# EasyEDA Pro project WukongY003.eprj, board PCB1
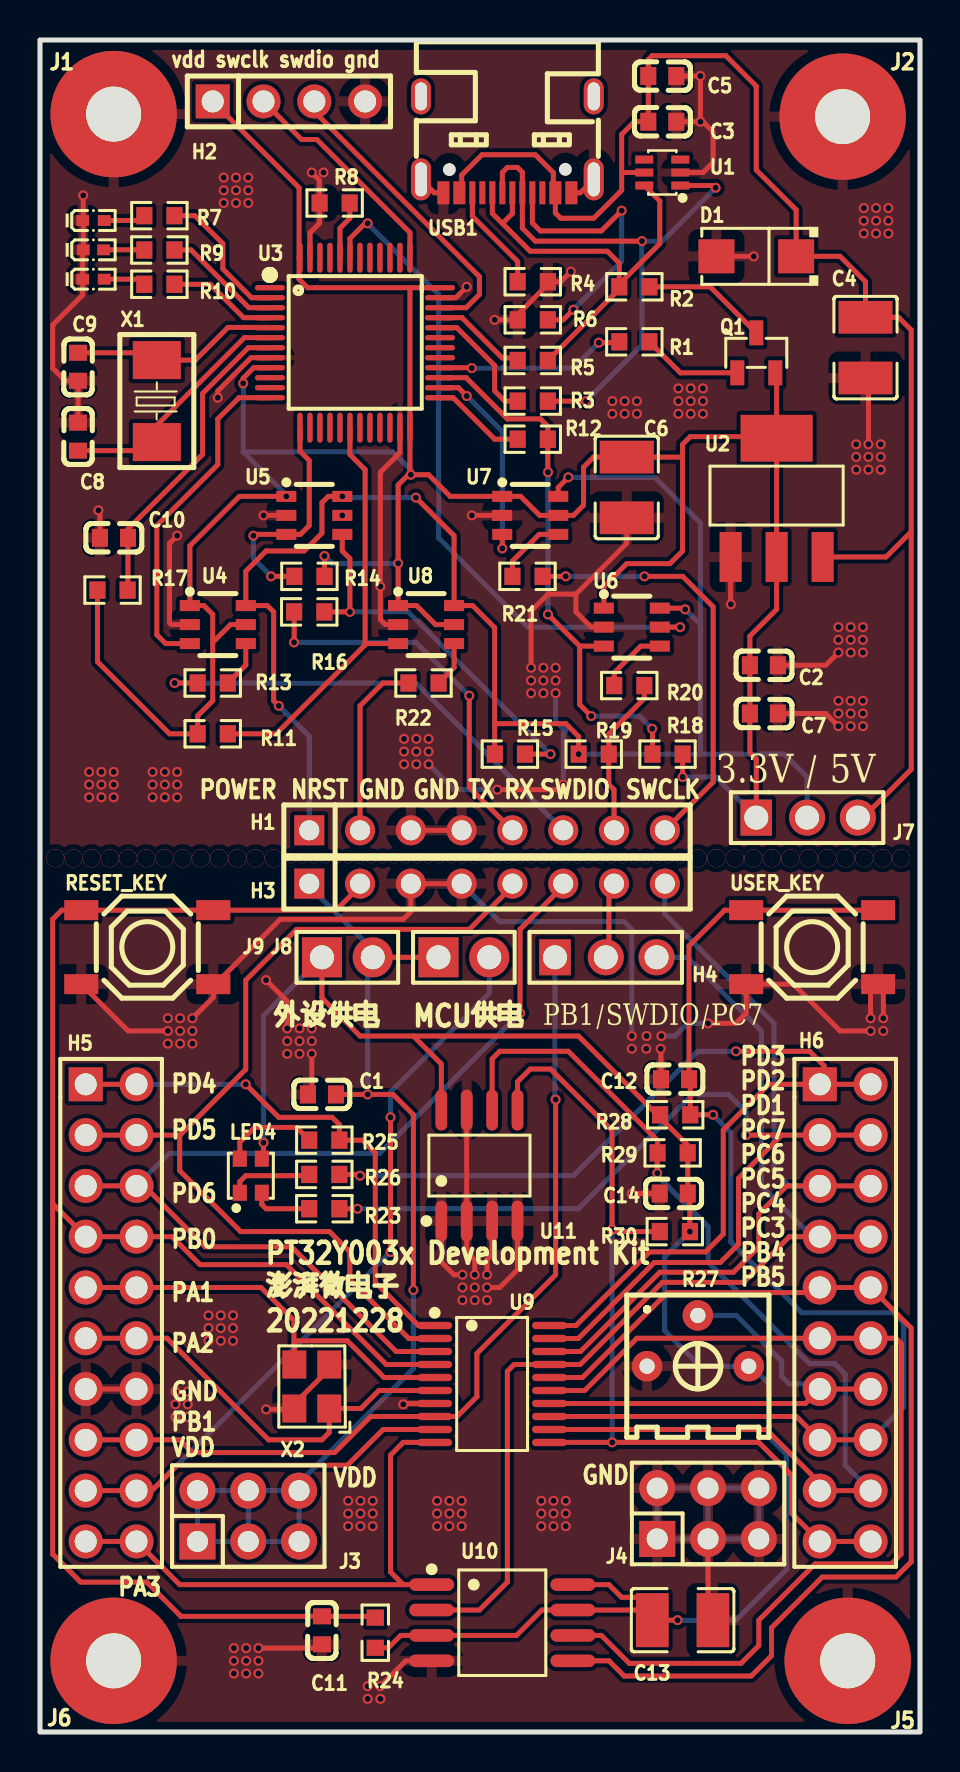
[diagram p3: board, top side]
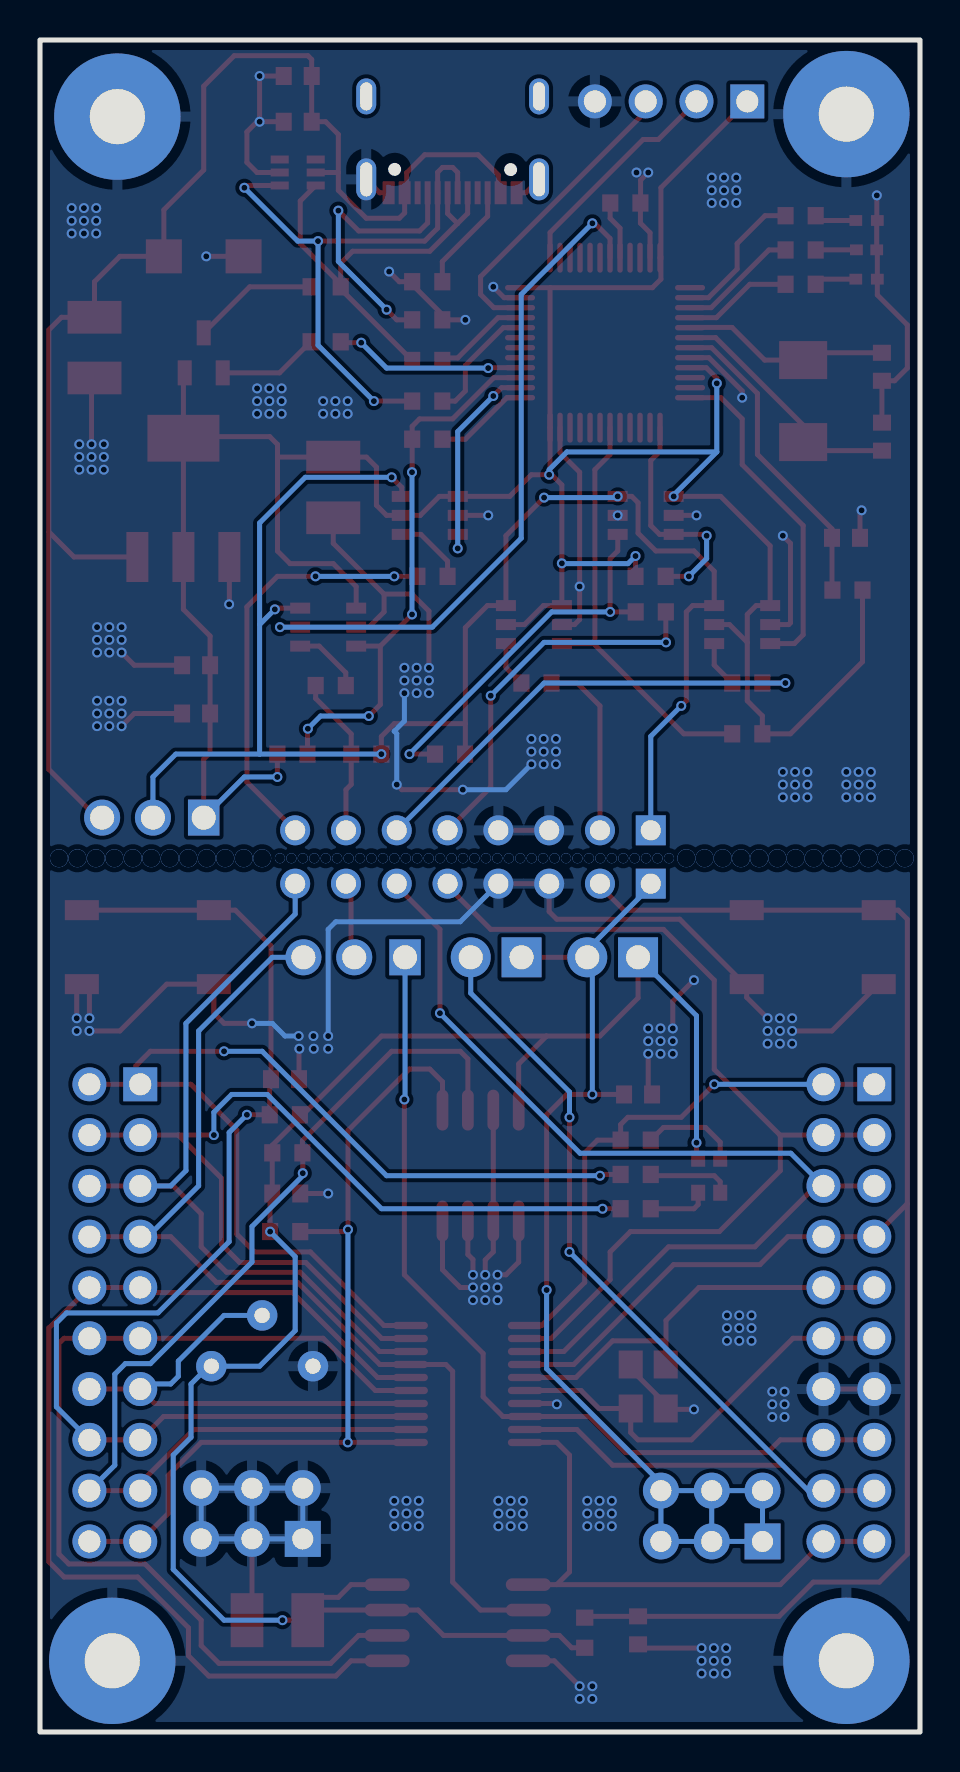
[diagram p4: board, bottom side, seen from below]

Outline 44 x 84.61 mm; copper layers: Top Layer, Bottom Layer. Coordinates in mm from the lower left corner of the outline.
Outline path: rectangle 0,84.61 44,0
Stack: Top Layer 0.035mm / Dielectric1 1.51mm FR4 er 4.5 / Bottom Layer 0.035mm

## Design rules (mm)
spacing safeClearance (default): track to track 0.152, other pairs 0.152 to 0.3
track width trackWidth (default): min 0.127, default 0.254, max 2.54
differential pair differentialPair (default): width min 0.127, default 0.254, max 2.54; gap min 0.152, default 0.152
via viaSize (default): diameter min 0.5, default 0.61, max 10; hole min 0.3, default 0.305, max 6
net 3.3V uses 铺铜-直连
net 5V uses 铺铜-直连

## Placement (name value [footprint] x y rotation side)
C1  100nF  [C0603]  14.1 31.88 0 top
C2  100nF  [C0603]  36.19 53.34 180 top
C3  100nF  [C0603]  31.11 80.52 180 top
C4  10uF  [C1210]  41.27 69.23 90 top
C5  100nF  [C0603]  31.11 82.81 180 top
C6  10uF  [C1210]  29.34 62.23 90 top
C7  100nF  [C0603]  36.19 50.93 180 top
C8  20pF  [C0603]  1.9 64.77 270 top
C9  20pF  [C0603]  1.91 68.27 90 top
C10  100nF  [C0603]  3.7 59.72 0 top
C11  100nF  [C0603]  14.1 5.08 90 top
C12  100nF  [C0603]  31.75 32.64 0 top
C13  10uF  [C1210]  32.13 5.59 0 top
C14  100nF  [C0603]  31.69 26.93 0 top
D1  SMAJ5.0CA  [SMA_L4.3-W2.7-LS4.7-RD]  35.81 73.79 180 top
H1  KH-2.54PH180-1X8P-L11.5  [HDR-TH_8P-P2.54-V-M]  22.35 45.09 0 top
H2  KH-2.54PH180-1X4P-L11.5  [HDR-TH_4P-P2.54-V-M]  12.45 81.54 0 top
H3  KH-2.54PH180-1X8P-L11.5  [HDR-TH_8P-P2.54-V-M]  22.35 42.42 0 top
H4  2.54-1*3  [HDR-TH_3P-P2.54-V-M-1]  28.29 38.74 0 top
H5  2.54-2*10  [HDR-TH_20P-P2.54-V-M-R2-C10-S2.54]  3.56 20.96 270 top
H6  2.54-2*10  [HDR-TH_20P-P2.54-V-M-R2-C10-S2.54]  40.26 20.96 270 top
J1  -  [DEMO板安装孔]  3.68 80.9 0 top
J2  -  [DEMO板安装孔]  40.13 80.78 0 top
J3  2.54-2*3P针  [HDR-TH_6P-P2.54-V-M-R2-C3-S2.54-1]  10.41 10.8 0 top
J4  2.54-2*3P针  [HDR-TH_6P-P2.54-V-M-R2-C3-S2.54-1]  33.4 10.93 0 top
J5  -  [DEMO板安装孔]  40.39 3.56 0 top
J6  -  [DEMO板安装孔]  3.68 3.56 0 top
J7  2.54-1*3  [HDR-TH_3P-P2.54-V-M-1]  38.35 45.72 0 top
J8  2.54-1*2  [HDR-TH_2P-P2.54-V-M]  21.19 38.74 0 top
J9  2.54-1*2  [HDR-TH_2P-P2.54-V-M]  15.37 38.74 0 top
LED1  RF-GN0402TS-CF-B  [LED0402-RD_GREEN]  2.67 75.58 0 top
LED2  RF-RU0402TS-BC-B1  [LED0402-RD_RED]  2.67 74.12 0 top
LED3  RF-GN0402TS-CF-B  [LED0402-RD_GREEN]  2.67 72.65 0 top
LED4  FM-B2020RGBA-HG  [LED-SMD_FM-B2020RGBA-HG]  10.54 27.82 90 top
Q1  SS8550 Y2  [SOT-23-3_L2.9-W1.3-P1.90-LS2.4-BR]  35.81 68.96 270 top
R1  1.5kΩ  [R0603]  29.72 69.52 180 top
R2  1.5kΩ  [R0603]  29.72 72.27 0 top
R3  27Ω  [R0603]  24.64 66.55 180 top
R4  5.1kΩ  [R0603]  24.64 72.52 0 top
R5  27Ω  [R0603]  24.64 68.58 180 top
R6  5.1kΩ  [R0603]  24.64 70.62 0 top
R7  4.7kΩ  [R0603]  5.97 75.82 0 top
R8  10kΩ  [R0603]  14.73 76.46 180 top
R9  4.7kΩ  [R0603]  5.97 74.11 0 top
R10  4.7kΩ  [R0603]  5.97 72.39 0 top
R11  10kΩ  [R0603]  8.64 49.91 0 top
R12  100Ω  [R0603]  24.64 64.65 0 top
R13  220Ω  [R0603]  8.64 52.45 180 top
R14  10kΩ  [R0603]  13.47 57.79 0 top
R15  10kΩ  [R0603]  23.5 48.9 0 top
R16  220Ω  [R0603]  13.46 56.01 180 top
R17  10kΩ  [R0603]  3.63 57.1 180 top
R18  10kΩ  [R0603]  31.38 48.9 0 top
R19  10kΩ  [R0603]  27.69 48.9 0 top
R20  220Ω  [R0603]  29.46 52.33 0 top
R21  220Ω  [R0603]  24.38 57.79 0 top
R22  220Ω  [R0603]  19.18 52.45 180 top
R23  4.7kΩ  [R0603]  14.22 26.17 180 top
R24  10kΩ  [R0603]  16.76 4.97 270 top
R25  4.7kΩ  [R0603]  14.22 29.59 180 top
R26  4.7kΩ  [R0603]  14.22 27.88 180 top
R27  环保  3362P-1-101LF  [RES-ADJ-TH_3362P]  32.89 19.56 0 top
R28  10kΩ  [R0603]  31.76 30.86 180 top
R29  10kΩ  [R0603]  31.63 28.96 0 top
R30  10kΩ  [R0603]  31.74 25.02 0 top
RESET_KEY  1TS001G-2500-1500-CT  [SW-SMD_4P-L5.1-W5.1-P3.70-LS6.5-TL-2]  5.36 39.25 0 top
U1  NUP4202W1T2G  [SOT-363_L2.0-W1.3-P0.65-LS2.1-BR]  31.11 77.98 0 top
U2  AMS1117-3.3  [SOT-223-3_L6.4-W3.5-P2.30-LS7.0-BR]  36.83 61.73 270 top
U3  STM32F103CBT6  [LQFP-48_L7.0-W7.0-P0.50-LS9.0-BL]  15.75 69.47 270 top
U4  SN74LVC1T45DBVR  [SOT-23-6_L2.9-W1.6-P0.95-LS2.8-BR]  8.89 55.38 180 top
U5  SN74LVC1T45DBVR  [SOT-23-6_L2.9-W1.6-P0.95-LS2.8-BR]  13.72 60.84 180 top
U6  SN74LVC1T45DBVR  [SOT-23-6_L2.9-W1.6-P0.95-LS2.8-BR]  29.59 55.25 180 top
U7  SN74LVC1T45DBVR  [SOT-23-6_L2.9-W1.6-P0.95-LS2.8-BR]  24.51 60.84 180 top
U8  SN74LVC1T45DBVR  [SOT-23-6_L2.9-W1.6-P0.95-LS2.8-BR]  19.3 55.38 180 top
U9  -  [TSSOP-20_L6.5-W4.4-P0.65-LS6.4-BL]  22.61 17.4 270 top
U10  W25Q64JVSSIQ  [SOIC-8_L5.3-W5.3-P1.27-LS8.0-BL]  23.11 5.47 270 top
U11  K24C02  [SOIC-8_L4.9-W3.9-P1.27-LS6.0-BL]  21.97 28.32 0 top
USB1  TYPEC-304-ACP16  [USB-C-SMD_TYPE-C-16P-1]  23.37 79.38 180 top
USER_KEY  1TS001G-2500-1500-CT  [SW-SMD_4P-L5.1-W5.1-P3.70-LS6.5-TL-2]  38.61 39.25 0 top
X1  8MHz  [CRYSTAL-SMD_L5.0-W3.2]  5.84 66.55 270 top
X2  25MHz  [OSC-SMD_4P-L3.2-W2.5-BL]  13.59 17.28 90 top

## Footprints (pads in the part's own frame, mm; a bottom-side part is the same pattern mirrored in y, then rotated)
C0603
  rect 0.8x0.9 smd: 1(-0.7,0) 2(0.7,0)
C1210
  rect 1.635x2.7 smd: 1(-1.518,0) 2(1.518,0)
CRYSTAL-SMD_L5.0-W3.2
  rect 1.9x2.401 smd: 1(-2.05,0) 2(2.05,0)
DEMO板安装孔
  round 6.32 hole 2.75: 1(0,0)
HDR-TH_2P-P2.54-V-M
  rect 2x2 hole 1.2: 1(-1.27,0)
  round 2 hole 1.2: 2(1.27,0)
HDR-TH_3P-P2.54-V-M-1
  rect 1.575x1.801 hole 1.199: 1(-2.54,0)
  round 1.801 hole 1.199: 2(0,0) 3(2.54,0)
HDR-TH_4P-P2.54-V-M
  rect 1.7x1.7 hole 1.1: 1(-3.81,0)
  round 1.7 hole 1.1: 2(-1.27,0) 3(1.27,0) 4(3.81,0)
HDR-TH_6P-P2.54-V-M-R2-C3-S2.54-1
  rect 1.801x1.801 hole 1.049: 1(-2.54,-1.27)
  round 1.801 hole 1.049: 2(-2.54,1.27) 3(0,-1.27) 4(0,1.27) 5(2.54,-1.27) 6(2.54,1.27)
HDR-TH_8P-P2.54-V-M
  rect 1.5x1.5 hole 1: 1(-8.89,0)
  round 1.5 hole 1: 2(-6.35,0) 3(-3.81,0) 4(-1.27,0) 5(1.27,0) 6(3.81,0) 7(6.35,0) 8(8.89,0)
HDR-TH_20P-P2.54-V-M-R2-C10-S2.54
  rect 1.7x1.7 hole 1.1: 1(-11.43,-1.27)
  round 1.7 hole 1.1: 2(-11.43,1.27) 3(-8.89,-1.27) 4(-8.89,1.27) 5(-6.35,-1.27) 6(-6.35,1.27) 7(-3.81,-1.27) 8(-3.81,1.27) 9(-1.27,-1.27) 10(-1.27,1.27) 11(1.27,-1.27) 12(1.27,1.27) 13(3.81,-1.27) 14(3.81,1.27) 15(6.35,-1.27) 16(6.35,1.27) 17(8.89,-1.27) 18(8.89,1.27) 19(11.43,-1.27) 20(11.43,1.27)
LED0402-RD_GREEN
  rect 0.637x0.541 smd: 1(-0.538,0) 2(0.538,0)
LED0402-RD_RED
  rect 0.637x0.541 smd: 1(-0.508,0) 2(0.508,0)
LED-SMD_FM-B2020RGBA-HG
  rect 0.8x0.701 smd: 1(-0.851,0.551) 2(0.851,0.551) 3(0.851,-0.551) 4(-0.851,-0.551)
LQFP-48_L7.0-W7.0-P0.50-LS9.0-BL
  oval 0.27x1.5 smd: 1(-2.75,-4.25) 2(-2.25,-4.25) 3(-1.75,-4.25) 4(-1.25,-4.25) 5(-0.75,-4.25) 6(-0.25,-4.25) 7(0.25,-4.25) 8(0.75,-4.25) 9(1.25,-4.25) 10(1.75,-4.25) 11(2.25,-4.25) 12(2.75,-4.25) 25(2.75,4.25) 26(2.25,4.25) 27(1.75,4.25) 28(1.25,4.25) 29(0.75,4.25) 30(0.25,4.25) 31(-0.25,4.25) 32(-0.75,4.25) 33(-1.25,4.25) 34(-1.75,4.25) 35(-2.25,4.25) 36(-2.75,4.25)
  oval 1.5x0.27 smd: 13(4.25,-2.75) 14(4.25,-2.25) 15(4.25,-1.75) 16(4.25,-1.25) 17(4.25,-0.75) 18(4.25,-0.25) 19(4.25,0.25) 20(4.25,0.75) 21(4.25,1.25) 22(4.25,1.75) 23(4.25,2.25) 24(4.25,2.75) 37(-4.25,2.75) 38(-4.25,2.25) 39(-4.25,1.75) 40(-4.25,1.25) 41(-4.25,0.75) 42(-4.25,0.25) 43(-4.25,-0.25) 44(-4.25,-0.75) 45(-4.25,-1.25) 46(-4.25,-1.75) 47(-4.25,-2.25) 48(-4.25,-2.75)
OSC-SMD_4P-L3.2-W2.5-BL
  rect 1.4x1.2 smd: 1(-1.1,-0.875) 2(1.1,-0.875) 3(1.1,0.875) 4(-1.1,0.875)
R0603
  rect 0.806x0.864 smd: 1(-0.753,0) 2(0.753,0)
RES-ADJ-TH_3362P
  round 1.524 hole 0.762: 1(-2.54,-1.27) 2(0,1.27) 3(2.54,-1.27)
SMA_L4.3-W2.7-LS4.7-RD
  rect 1.8x1.7 smd: 1(-1.992,0) 2(1.992,0)
SOIC-8_L4.9-W3.9-P1.27-LS6.0-BL
  oval 0.588x2.045 smd: 1(-1.905,-2.772) 2(-0.635,-2.772) 3(0.635,-2.772) 4(1.905,-2.772) 5(1.905,2.772) 6(0.635,2.772) 7(-0.635,2.772) 8(-1.905,2.772)
SOIC-8_L5.3-W5.3-P1.27-LS8.0-BL
  oval 0.63x2.25 smd: 1(-1.905,-3.53) 2(-0.635,-3.53) 3(0.635,-3.53) 4(1.905,-3.53) 5(1.905,3.53) 6(0.635,3.53) 7(-0.635,3.53) 8(-1.905,3.53)
SOT-23-3_L2.9-W1.3-P1.90-LS2.4-BR
  rect 1.25x0.7 smd: 1(1,-0.95) 2(1,0.95) 3(-1,0)
SOT-23-6_L2.9-W1.6-P0.95-LS2.8-BR
  rect 1x0.55 smd: 1(1.4,-0.95) 2(1.4,0) 3(1.4,0.95) 4(-1.4,0.95) 5(-1.4,0) 6(-1.4,-0.95)
SOT-223-3_L6.4-W3.5-P2.30-LS7.0-BR
  rect 2.499x1.1 smd: 1(2.97,-2.299) 2(2.97,0) 3(2.97,2.301)
  rect 2.34x3.599 smd: 4(-2.97,0)
SOT-363_L2.0-W1.3-P0.65-LS2.1-BR
  rect 0.9x0.4 smd: 1(0.9,-0.65) 2(0.9,0) 3(0.9,0.65) 4(-0.9,0.65) 5(-0.9,0) 6(-0.9,-0.65)
SW-SMD_4P-L5.1-W5.1-P3.70-LS6.5-TL-2
  rect 1.7x1 smd: 1(-3.3,1.85) 2(3.3,1.85) 3(-3.3,-1.85) 4(3.3,-1.85)
TSSOP-20_L6.5-W4.4-P0.65-LS6.4-BL
  oval 0.364x1.742 smd: 1(-2.925,-2.871) 2(-2.275,-2.871) 3(-1.625,-2.871) 4(-0.975,-2.871) 5(-0.325,-2.871) 6(0.325,-2.871) 7(0.975,-2.871) 8(1.625,-2.871) 9(2.275,-2.871) 10(2.925,-2.871) 11(2.925,2.871) 12(2.275,2.871) 13(1.625,2.871) 14(0.975,2.871) 15(0.325,2.871) 16(-0.325,2.871) 17(-0.975,2.871) 18(-1.625,2.871) 19(-2.275,2.871) 20(-2.925,2.871)
USB-C-SMD_TYPE-C-16P-1
  rect 0.6x1.15 smd: A1B12(-3.2,2.41) A4B9(-2.4,2.41) B1A12(3.2,2.41) B4A9(2.4,2.41)
  rect 0.3x1.15 smd: A5(-1.25,2.41) A6(-0.25,2.41) A7(0.25,2.41) A8(1.25,2.41) B5(1.75,2.41) B6(0.75,2.41) B7(-0.75,2.41) B8(-1.75,2.41)
  oval 1x2.1 hole 0.6x1.7: EP(-4.32,1.74) EP(4.32,1.74)
  oval 1x1.8 hole 0.6x1.4: EP(-4.32,-2.41) EP(4.32,-2.41)

## Nets
As in the schematic.

Pads without a net: U1 3 4; U3 1 10 11 14 15 16 17 19 20 21 22 29 30 31 38 39 40 41 42 45 46; USB1 A8 B8

## Via types
v1: diameter 0.9, hole 0.9, Top Layer to Bottom Layer, 25 vias
v2: diameter 0.5, hole 0.5, Top Layer to Bottom Layer, 35 vias
v3: diameter 0.5, hole 0.3, Top Layer to Bottom Layer, 266 vias

## Routing (per net, layer and track width the routed paths; a pad name or vN(x,y) marks a point on that pad's centre or on a via; arc(x,y) is an arc through that point)
3.3V: length 149.7
  Top Layer w0.25: 35.81,45.47 35.81,48.64 35.5,48.96 C7.2 C2.2 35.5,54.8 36.83,56.14 U2.2 U2.4 ; R17.2 2.87,53.52 6.48,49.91 R11.1 7.88,50.81 8.64,51.57 8.64,54.49 ; U2.4 36.83,67.9 Q1.2 ; U2.4 36.75,64.77 32.51,64.77 32.12,64.39 32.12,63.75 ; 18.47,72.22 18.5,72.2 U3.24 18.5,62.91 v3(18.54,62.87) ; 18.47,72.22 13.38,72.22 12.95,72.65 12.95,73.68 U3.48 12.95,73.77 12.95,77.22 H2.1 ; 18.47,72.22 U3.36 ; 32.12,63.75 32.12,59.05 31.5,58.42 29.34,58.42 28.19,57.28 U6.1 ; 32.12,63.75 C6.2 27.68,63.75 27.18,63.25 27.18,61.34 26.67,60.84 U7.5 24.99,60.84 24.04,61.79 U7.1 20.51,61.79 19.43,62.87 v3(18.54,62.87) ; U4.5 9.52,55.38 8.64,54.49 ; 8.64,54.49 8.64,55.88 8.19,56.33 U4.1 7.49,56.33 7.49,59.31 9.97,61.79 v3(12.32,61.79) ; v3(32.13,47.76) R18.2 ; v3(18.54,62.87) 18.41,62.87 17.91,62.36 v3(17.91,58.44) 17.91,56.33 U8.1 18.83,56.33 19.78,55.38 U8.5 ; U3.9 10.69,68.22 10.16,67.69 v3(10.16,67.44) ; v3(14.22,58.8) R14.2
  Bottom Layer w0.25: 10.16,64.01 12.32,61.85 ; 10.16,64.01 17.65,64.01 18.54,63.12 v3(18.54,62.87) ; 10.16,64.01 v3(10.16,67.44) ; v3(14.22,58.8) 14.6,58.42 17.91,58.42 ; J7.1 33.78,47.76 v3(32.13,47.76)
5V: length 75.5
  Top Layer w0.25: 29.08,77.98 U1.5 ; 29.08,77.98 29.08,77.09 27.69,75.7 26.03,75.7 25.77,75.96 USB1.A4B9 25.67,77.07 25.67,77.97 24.76,78.87 22.1,78.87 21.08,77.85 21.08,77.08 USB1.B4A9 ; 29.08,77.98 29.08,79.89 29.72,80.52 C3.2 C5.2 30.41,83.63 30.61,83.82 34.29,83.82 35.81,82.3 35.81,78.11 37.81,76.12 D1.1 40,73.79 41.27,72.52 C4.2 42.93,70.74 43.56,70.11 43.56,60.02 ; 43.56,60.02 43.56,48.14 40.89,45.47 ; 43.56,60.02 42.3,58.76 U2.3
GND: length 219.8
  Top Layer w0.25: v3(22.35,22.86) 22.35,23.63 22.61,23.88 U11.3 ; v3(10.92,4.19) 13.91,4.19 C11.1 ; C10.1 3,61.01 v3(2.92,61.09) ; U11.1 20.07,23.5 20.7,22.86 v3(21.12,22.86) ; v3(26.16,47.37) 25.91,47.12 v3(22.86,47.12) ; v3(41.42,64.39) 41.42,67.56 C4.1 ; v3(2.16,76.84) 2.16,75.61 LED1.1 2.16,75.55 LED2.1 2.13,74.08 LED3.1 2.13,71.86 0.63,70.36 0.63,68.2 1.27,67.57 C9.1 1.91,65.48 C8.1 ; v3(33.4,35.44) 34.8,35.44 35.31,35.95 USER_KEY.3 37.66,37.4 40,35.06 v3(41.53,35.06) ; X2.2 14.46,18.15 12.71,16.4 X2.4 12.67,16.13 v3(11.3,16.13) ; RESET_KEY.3 4.41,35.06 v3(6.39,35.06) ; U4.2 6.56,55.38 6.48,55.46 6.48,59.44 v3(6.86,59.82) ; v3(12.36,35.18) 12.36,36.54 11.43,37.47 ; C6.1 29.34,59.44 26.8,56.9 ; C13.2 33.4,5.84 J4.3 ; 26.8,56.9 25.4,56.9 24.55,56.05 v3(24.55,53.22) ; 26.8,56.9 26.8,56.01 27.56,55.25 U6.2 ; U10.4 18.29,3.56 v3(17.02,2.29) ; v3(33.02,80.52) v3(33.02,82.81) C5.1 ; v3(33.02,80.52) C3.1 ; v3(33.02,80.52) 33.15,80.52 33.66,80.01 33.66,78.49 33.15,77.98 U1.2 ; U8.2 17.27,55.38 17.02,55.63 v3(17.02,57.28) 17.02,63 18,63.98 U3.23 ; USB1.EP 19.72,76.97 USB1.B1A12 ; USB1.A1B12 27.02,76.97 USB1.EP ; v3(41.53,35.69) 41.53,37.02 USER_KEY.4 42.16,37.14 v3(42.16,35.69) ; U7.2 v3(21.59,60.84) ; C1.1 13.59,32.07 v3(13.59,33.91) ; C2.1 39.28,53.34 v3(39.92,53.98) ; 12.32,60.84 v3(11.18,60.84) ; v3(21.74,22.86) 21.74,23.6 21.34,24.01 U11.2 U11.7 ; 8.89,66.81 8.89,67.06 10.55,68.72 U3.8 ; v3(22.73,70.62) R6.1 23.88,70.88 25.39,72.39 R4.2 26.03,72.52 v3(26.54,73.03) ; v3(29.59,26.93) C14.1 ; v3(18.16,16.39) 18.2,16.43 U9.7 ; v3(7.62,35.69) 8.66,36.74 RESET_KEY.4 8.77,37.4 12.01,40.64 18.16,40.64 18.54,41.02 H3.3 H3.4 ; v3(13.59,77.98) 13.97,77.6 13.97,76.47 R8.2 13.98,75.45 13.5,74.97 U3.47 ; C7.1 39.28,50.93 v3(39.92,50.3) ; v3(21.34,72.27) 20.79,71.72 U3.35 ; v3(31.03,34.17) 31.05,34.15 31.05,32.64 ; v3(34.54,56.39) 34.53,56.4 U2.1 ; v3(22.35,22.23) 22.99,22.23 23.88,23.12 U11.4 ; H5.13 H5.14 ; D1.2 v3(35.69,73.79) ; H1.3 H1.4
  Bottom Layer w0.25: v3(25.78,51.95) 25.78,50.55 26.29,50.04 26.16,49.91 v3(26.16,47.37) ; J4.3 J4.4 ; J4.3 J4.5 J4.6 J4.4 ; J4.3 J4.1 J4.2 J4.4 ; v3(29.59,34.8) 29.59,40.14 29.21,40.52 22.99,40.52 H3.4 ; v3(33.4,35.44) 32.38,35.44 31.75,34.8 v3(31.07,34.8) ; v3(19.43,48.39) 20.7,47.12 v3(22.86,47.12)
  vias: v3(2.45,48.01) v3(2.45,47.37) v3(2.45,46.74) v3(3.07,48.01) v3(3.07,47.37) v3(3.07,46.74) v3(3.68,48.01) v3(3.68,47.37) v3(3.68,46.74) v3(5.63,48.01) v3(5.63,47.37) v3(5.63,46.74) v3(6.24,48.01) v3(6.24,47.37) v3(6.24,46.74) v3(6.39,35.69) v3(6.39,34.42) v3(6.77,17.02) v3(6.77,16.39) v3(6.77,15.75) v3(6.86,48.01) v3(6.86,47.37) v3(6.86,46.74) v3(7.01,35.69) v3(7.01,35.06) v3(7.01,34.42) v3(7.39,17.02) v3(7.39,16.39) v3(7.39,15.75) v3(7.62,35.06) v3(7.62,34.42) v3(8.42,20.83) v3(8.42,20.2) v3(8.42,19.56) v3(8.89,66.72) v3(9.04,20.83) v3(9.04,20.2) v3(9.04,19.56) v3(9.19,77.73) v3(9.19,77.09) v3(9.19,76.46) v3(9.65,20.83) v3(9.65,20.2) v3(9.65,19.56) v3(9.69,4.19) v3(9.69,3.56) v3(9.69,2.92) v3(9.8,77.73) v3(9.8,77.09) v3(9.8,76.46) v3(10.31,4.19) v3(10.31,3.56) v3(10.31,2.92) v3(10.41,77.73) v3(10.41,77.09) v3(10.41,76.46) v3(10.92,3.56) v3(10.92,2.92) v3(11.3,37.6) v3(12.36,34.55) v3(12.36,33.91) v3(12.97,35.18) v3(12.97,34.55) v3(12.97,33.91) v3(13.59,35.18) v3(13.59,34.55) v3(14.18,77.98) v3(15.12,60.84) v3(15.41,11.56) v3(15.41,10.93) v3(15.41,10.29) v3(16.02,11.56) v3(16.02,10.93) v3(16.02,10.29) v3(16.38,2.29) v3(16.38,1.66) v3(16.64,11.56) v3(16.64,10.93) v3(16.64,10.29) v3(17.02,1.66) v3(18.2,49.66) v3(18.2,49.03) v3(18.2,48.39) v3(18.82,49.66) v3(18.82,49.03) v3(18.82,48.39) v3(19.43,49.66) v3(19.43,49.03) v3(19.85,11.56) v3(19.85,10.93) v3(19.85,10.29) v3(20.47,11.56) v3(20.47,10.93) v3(20.47,10.29) v3(21.08,11.56) v3(21.08,10.93) v3(21.08,10.29) v3(21.12,22.23) v3(21.12,21.59) v3(21.74,22.23) v3(21.74,21.59) v3(22.35,21.59) v3(24.55,52.58) v3(24.55,51.95) v3(25.06,11.56) v3(25.06,10.93) v3(25.06,10.29) v3(25.17,53.22) v3(25.17,52.58) v3(25.17,51.95) v3(25.67,11.56) v3(25.67,10.93) v3(25.67,10.29) v3(25.78,53.22) v3(25.78,52.58) v3(26.29,11.56) v3(26.29,10.93) v3(26.29,10.29) v3(28.62,66.55) v3(28.62,65.92) v3(29.23,66.55) v3(29.23,65.92) v3(29.59,34.17) v3(29.84,66.55) v3(29.84,65.92) v3(30.31,34.17) v3(30.33,34.8) v3(31.92,67.19) v3(31.92,66.55) v3(31.92,65.92) v3(32.53,67.19) v3(32.53,66.55) v3(32.53,65.92) v3(33.15,67.19) v3(33.15,66.55) v3(33.15,65.92) v3(39.92,55.25) v3(39.92,54.61) v3(39.92,51.57) v3(39.92,50.93) v3(40.53,55.25) v3(40.53,54.61) v3(40.53,53.98) v3(40.53,51.57) v3(40.53,50.93) v3(40.53,50.3) v3(40.81,64.39) v3(40.81,63.76) v3(40.81,63.12) v3(41.19,76.2) v3(41.19,75.57) v3(41.19,74.93) v3(41.15,55.25) v3(41.15,54.61) v3(41.15,53.98) v3(41.15,51.57) v3(41.15,50.93) v3(41.15,50.3) v3(41.42,63.76) v3(41.42,63.12) v3(41.8,76.2) v3(41.8,75.57) v3(41.8,74.93) v3(42.04,64.39) v3(42.04,63.76) v3(42.04,63.12) v3(42.16,35.06) v3(42.42,76.2) v3(42.42,75.57) v3(42.42,74.93)
(no net):
  vias: v1(0.76,43.69) v1(1.67,43.69) v1(2.58,43.69) v1(3.49,43.69) v1(4.4,43.69) v1(5.31,43.69) v1(6.22,43.69) v1(7.13,43.69) v1(8.04,43.69) v1(8.95,43.69) v1(9.86,43.69) v1(10.77,43.69) v1(11.68,43.69) v1(32.89,43.69) v1(33.82,43.69) v1(34.74,43.69) v1(35.66,43.69) v1(36.59,43.69) v1(37.51,43.69) v1(38.44,43.69) v1(39.36,43.69) v1(40.28,43.69) v1(41.21,43.69) v1(42.13,43.69) v1(43.05,43.69) v2(12.55,43.69) v2(13.12,43.69) v2(13.7,43.69) v2(14.27,43.69) v2(14.84,43.69) v2(15.41,43.69) v2(15.98,43.69) v2(16.56,43.69) v2(17.13,43.69) v2(17.7,43.69) v2(18.27,43.69) v2(18.84,43.69) v2(19.42,43.69) v2(19.99,43.69) v2(20.56,43.69) v2(21.13,43.69) v2(21.71,43.69) v2(22.28,43.69) v2(22.85,43.69) v2(23.42,43.69) v2(23.99,43.69) v2(24.57,43.69) v2(25.14,43.69) v2(25.71,43.69) v2(26.28,43.69) v2(26.85,43.69) v2(27.43,43.69) v2(28,43.69) v2(28.57,43.69) v2(29.14,43.69) v2(29.72,43.69) v2(30.29,43.69) v2(30.86,43.69) v2(31.43,43.69) v2(32,43.69)
AD5/PD3: length 52.2
  Top Layer w0.25: 39.2,32.39 41.53,32.39 ; 39.2,32.39 39.2,33.32 38.48,34.04 v3(34.8,34.04) ; 39.2,32.39 36.45,32.39 34.16,30.1 34.16,24.9 33.27,24.01 30.48,24.01 26.8,20.33 U9.20 ; v3(16,27.82) 15.94,27.88 R26.1
  Bottom Layer w0.25: v3(34.8,34.04) 32.89,34.04 26.67,27.82 v3(16,27.82)
AD6/TIM1_CH3N/PD2: length 48.2
  Top Layer w0.25: 37.08,29.85 34.92,27.69 34.92,24.39 34.01,23.48 30.71,23.48 26.91,19.68 U9.19 ; 37.08,29.85 v3(35.31,29.85) ; 37.08,29.85 41.53,29.85 ; R23.1 v3(15.88,26.17)
  Bottom Layer w0.25: v3(15.88,26.17) 26.92,26.17 32.64,31.88 34.42,31.88 35.31,30.99 v3(35.31,29.85)
AD7/TIM1_CH2N/MCO/TIM1_CH4/PC4: length 24.4
  Top Layer w0.25: H6.14 H6.13 38.27,16.43 U9.14
  Bottom Layer w0.25: H6.13 38.73,17.4 37.47,17.4 37.08,17.78 37.08,18.55 34.8,20.83 R27.2
CMSIS_NRST: length 15.7
  Top Layer w0.25: U3.7 10.42,69.22 8.13,66.93 8.13,63.88 4.4,60.16 C10.2 4.4,57.12 R17.1
D+: length 22.6
  Top Layer w0.25: 23.12,75.43 23.62,75.93 USB1.A6 ; 23.12,75.43 22.62,75.94 USB1.B6 ; 23.12,75.43 24.51,74.04 28.37,74.04 28.96,73.45 28.96,72.4 ; 28.96,72.4 28.96,72.16 R5.1 ; 28.96,72.4 30.99,74.43 30.99,76.56 U1.6
D-: length 28.9
  Top Layer w0.25: 30.09,74.56 30.08,74.55 24.76,74.55 24.12,75.2 USB1.B7 24.12,77.99 23.88,78.24 23.37,78.24 23.12,77.99 USB1.A7 ; U1.1 33.67,77.33 v3(33.78,77.22) ; R3.1 v3(27.3,66.55)
  Bottom Layer w0.25: v3(33.78,77.22) 31.11,74.55 v3(30.1,74.55) 30.1,69.35 v3(27.3,66.55)
D_SWCLK: length 11.3
  Top Layer w0.25: H2.2 13.08,79.63 13.84,79.63 18.5,74.98 U3.37
D_SWDIO: length 15.3
  Top Layer w0.25: H2.3 13.72,81.03 21.97,72.77 21.97,71.89 21.31,71.22 U3.34
DEBUG_OSC_IN: length 10.4
  Top Layer w0.25: U3.5 11.49,70.23 9.4,70.23 7.76,68.6 X1.1 5.48,68.97 C9.2
DEBUG_OSC_OUT: length 12.4
  Top Layer w0.25: U3.6 11.49,69.73 10.22,69.73 5.84,65.35 X1.2 5.41,64.07 C8.2
DM: length 6.2
  Top Layer w0.25: R3.2 23.24,66.55 22.73,67.06 22.73,68.33 20.84,70.22 U3.32
DP: length 4.8
  Top Layer w0.25: U3.33 21.1,70.72 23.11,68.71 23.76,68.71 R5.2
I2C_SCL/PB4: length 53.1
  Top Layer w0.25: H6.18 H6.17 38.99,12.45 36.31,15.13 U9.12 ; U11.6 22.61,33.66 22.99,34.04 26.42,34.04 30.88,29.58 R29.1 30.86,28.94 v3(30.86,27.94)
  Bottom Layer w0.25: H6.18 40.26,13.34 40.26,17.89 39.73,18.42 38.48,18.42 33.4,23.5 33.4,25.28 30.86,27.82 v3(30.86,27.94)
I2C_SDA/PB5: length 44.9
  Top Layer w0.25: H6.20 H6.19 37.59,10.93 37.59,12.83 35.94,14.48 v3(28.61,14.48) 25.48,14.48 U9.11 ; U11.5 23.88,32.52 24.51,33.15 25.53,33.15 28.6,30.08 v3(28.6,25.12) ; 28.56,25.02 R30.1
  Bottom Layer w0.25: 28.6,14.51 v3(28.6,25.12)
LED_ALARM: length 6
  Top Layer w0.25: U3.3 10.44,71.22 7.56,74.11 R9.2
LED_DEBUG/UART: length 5.5
  Top Layer w0.25: R10.2 8.51,72.39 10.18,70.72 U3.4
LED_USB: length 7.2
  Top Layer w0.25: R7.2 7.75,75.82 9.14,74.43 9.14,73.16 10.58,71.72 U3.2
MAIN_POWER: length 58.4
  Top Layer w0.25: C1.2 v3(16.38,31.88) 17.65,31.88 18.67,30.86 v3(18.67,22.1) ; J9.2 J8.1
  Bottom Layer w0.25: J3.6 12.95,12.45 18.67,18.16 v3(18.67,22.1) ; J3.6 J3.5 J3.3 ; J3.6 J3.4 ; J3.3 J3.1 J3.2 J3.4 ; J3.3 J3.4 ; v3(16.38,31.88) 16.38,38.48 J9.2 16.64,39.12 13.46,42.29
MAIN_POWER/: length 83.1
  Top Layer w0.25: v3(26.42,62.74) 25.91,62.24 U7.6 ; v3(15.12,61.79) 14.41,61.79 14.1,61.47 14.1,59.95 13.21,59.06 11.3,59.06 10.29,58.05 U4.6 11.37,56.33 11.68,56.01 11.68,51.57 v3(11.94,51.31) ; v3(18.8,61.73) 20.7,59.82 U8.6 21.63,56.33 22.73,55.22 22.73,50.42 ; 22.73,50.42 22.73,48.91 R15.1 ; 22.73,50.42 26.29,50.42 26.93,49.78 v3(26.93,48.9) ; U6.6 32.2,56.2 v3(32.26,56.14)
  Bottom Layer w0.25: v3(15.12,61.79) 15.18,61.73 v3(18.8,61.73) ; 26.92,48.9 33.02,48.9 ; 33.02,48.9 33.02,55.38 ; 33.02,48.9 37.21,48.9 38.35,47.76 38.35,45.47 ; 33.02,55.38 33.02,60.46 30.73,62.74 v3(26.42,62.74) ; 33.02,55.38 v3(32.26,56.14) ; v3(11.94,51.31) 13.46,49.79 H1.1
MCU_POWER: length 53.1
  Top Layer w0.25: U9.9 17.16,15.13 15.37,13.34 6.86,13.34 5.59,12.07 H5.18 H5.17 ; v3(17.53,30.74) v3(17.53,24.01)
  Bottom Layer w0.25: H5.18 5.59,12.07 v3(17.53,24.01) ; v3(17.53,30.74) 17.53,32.01 22.46,36.94 J8.2
PA1/OSCIN/AD1: length 22.1
  Top Layer w0.25: X2.3 12.71,18.56 ; 12.71,18.56 12.7,18.57 12.7,20.58 11.05,22.23 2.29,22.23 ; 12.71,18.56 12.71,19.56 15.37,19.56 17.2,17.73 U9.5
PA2/OSCOUT/AD0: length 21.3
  Top Layer w0.25: U9.6 16.95,17.08 16.04,16.18 X2.1 14.46,14.98 14.1,14.61 11.43,14.61 6.35,19.69 H5.12 H5.11
PA3/SPI_NSS: length 27.4
  Top Layer w0.25: U10.1 18.16,7.37 ; 18.16,7.37 17.53,8 17.53,13.85 18.16,14.48 19.73,14.48 U9.10 ; 18.16,7.37 6.98,7.37 H5.20 H5.19
PB0/NRST: length 87.7
  Top Layer w0.25: 16,42.29 14.8,41.1 RESET_KEY.2 RESET_KEY.1 1.09,41.1 0.63,40.64 0.63,26.42 ; 0.63,26.42 0.63,8.89 2.03,7.5 5.33,7.5 7.05,5.78 C11.2 16.7,5.78 R24.1 ; 0.63,26.42 2.29,24.77 6.6,24.77 8,23.37 12.32,23.37 17.31,18.38 U9.4
PB0/NRST/: length 9.1
  Top Layer w0.25: R22.2 17.14,52.45 16,51.31 16,45.09
PB1/SWDIO: length 44.6
  Top Layer w0.25: 2.29,14.61 6.98,14.61 7.62,13.97 14.73,13.97 16.54,15.78 U9.8 20.85,15.78 21.84,16.77 21.84,18.93 25.78,22.86 v3(25.78,31.63)
  Bottom Layer w0.25: H4.1 25.75,31.66 v3(25.78,31.63)
PB1/SWDIO/: length 8.1
  Top Layer w0.25: H1.7 28.7,47.12 28.44,47.38 R19.2 28.44,49.91 30.22,51.68 R20.2
PD4/AD4: length 26.7
  Top Layer w0.25: U9.1 18.92,20.33 16.76,22.48 16.76,28.96 16.13,29.59 R25.1 14.97,30.37 14.6,30.74 11.94,30.74 v3(10.29,32.39) ; 2.29,32.39 4.83,32.39
  Bottom Layer w0.25: 4.83,32.39 v3(10.29,32.39)
PD5/UART_TX/AD3: length 47.9
  Top Layer w0.25: 7,29.85 2.29,29.85 ; 7,29.85 6.98,29.83 6.98,28.07 10.03,25.02 14.48,25.02 15.49,24.01 15.49,22.62 18.44,19.68 U9.2 ; 7,29.85 10.29,33.13 10.29,37.6 12.83,40.14 21.46,40.14 23.62,42.29
PD5/UART_TX/AD3/: length 19
  Top Layer w0.25: v3(12.7,54.49) 12.71,54.5 R16.2 ; 23.62,45.09 21.46,47.25 v3(21.46,51.82)
  Bottom Layer w0.25: v3(21.46,51.82) 18.8,54.49 v3(12.7,54.49)
PD6/UART_RX/AD2: length 50.9
  Top Layer w0.25: v3(24,35.94) 24,40.14 26.16,42.29 ; H5.5 H5.6 5.21,27.31 8.25,24.26 12.57,24.26 17.81,19.03 U9.3
  Bottom Layer w0.25: H5.6 6.46,28.94 17,28.94 v3(24,35.94)
PD6/UART_RX/AD2/: length 23.6
  Top Layer w0.25: R13.2 v3(6.73,52.45)
  Bottom Layer w0.25: v3(6.73,52.45) 18.8,52.45 26.16,45.09
PERIPHERAL_POWER: length 92.1
  Top Layer w0.25: U10.8 28.45,7.37 29.08,6.73 30.61,6.73 30.61,6.73 30.61,6.1 U10.7 25.09,6.1 23.82,4.83 U10.3 18.03,4.83 17.42,4.21 R24.2 ; 18.69,34.8 26.92,34.8 30.86,30.86 R28.2 31.01,30.72 32.39,29.34 R29.2 32.39,28.96 C14.2 32.49,26.82 v3(32.49,25.02) ; 18.69,34.8 18.69,34.79 20.07,33.4 U11.8 ; 18.69,34.8 16,34.8 14.1,36.71 J9.1 ; LED4.3 11.18,28.75 v3(11.18,29.47) ; C13.1 v3(31.88,5.59)
  Bottom Layer w0.25: v3(31.88,5.59) 34.8,5.59 37.34,8.13 37.34,13.85 36.45,14.74 36.45,17.4 35.56,18.29 R27.3 33.02,18.29 31.24,20.07 31.24,23.77 v3(32.49,25.02) ; v3(11.18,29.47) 11.18,35.82 J9.1
SPI_MOSI/TIM1_CH1/PC6: length 52.9
  Top Layer w0.25: U9.16 27.12,17.73 31.37,21.97 38.73,21.97 38.99,22.23 41.53,22.23 43.56,20.2 43.56,8.51 42.8,7.75 39.12,7.75 36.58,5.21 36.58,3.81 35.56,2.8 29.21,2.8 28.45,3.56 U10.5
SPI_SCK/PC5: length 49.3
  Top Layer w0.25: U9.15 27.23,17.08 29.84,19.69 H6.11 H6.12 42.8,19.69 43.05,19.44 43.05,8.89 42.56,8.4 38.75,8.4 35.94,5.59 35.94,4.32 35.05,3.43 29.46,3.43 28.07,4.83 U10.6
SWDCLK/PD1: length 39.5
  Top Layer w0.25: U9.18 27.02,19.03 30.99,22.99 34.67,22.99 35.94,24.26 35.94,25.91 37.34,27.31 H6.5 H6.6
  Bottom Layer w0.25: 31.24,42.29 31.24,40.9 36.7,35.44 36.7,28.07 37.47,27.31 H6.5
SWDCLK/PD1/: length 21.3
  Top Layer w0.25: v3(26.29,57.79) R21.2 ; v3(30.23,57.79) 32.13,57.79 33.66,56.26 33.66,47.5 31.24,45.09
  Bottom Layer w0.25: v3(26.29,57.79) v3(30.23,57.79)
SWDIO/SECLET: length 3.7
  Top Layer w0.25: 28.7,42.29 28.45,42.04 28.45,38.9 H4.2
SWDIO/SPI_MISO/TIM2_CH2/PC7: length 54.3
  Top Layer w0.25: U10.2 21.97,6.1 23.37,7.5 23.37,18.04 23.71,18.38 U9.17 27.01,18.38 31.11,22.48 35.18,22.48 37.47,24.77 41.53,24.77
  Bottom Layer w0.25: H4.3 32.38,38.74 36.07,35.06 36.07,27.31 38.61,24.77 38.99,24.77
SWDIO_DIR: length 34.3
  Top Layer w0.25: U6.5 v3(32,55.25) ; v3(16.38,75.44) 16.26,75.44 15.5,74.68 U3.43
  Bottom Layer w0.25: v3(32,55.25) 24.38,55.25 19.94,59.69 19.94,71.89 v3(16.38,75.44)
TIM1_CH1N/TIM1_CH3/PC3: length 59.9
  Top Layer w0.25: USER_KEY.2 USER_KEY.1 34.23,41.1 32.45,39.31 C12.2 32.51,32.58 R28.1 v3(33.66,30.86) ; U9.13 37.82,15.78 38.99,14.61 41.53,14.61
  Bottom Layer w0.25: 41.53,14.61 43.18,16.26 43.18,20.45 42.67,20.96 38.1,20.96 34.54,24.51 34.54,29.98 v3(33.66,30.86)
TODEMO_NRST: length 21.6
  Top Layer w0.25: U8.3 16.32,54.43 16.26,54.49 ; 16.26,54.49 16.26,54.36 11.81,49.91 R11.2 ; 16.26,54.49 16.26,63.12 15.5,63.88 U3.18
TODEMO_SWCLK: length 10.6
  Top Layer w0.25: U3.26 20.92,67.22 v3(21.34,66.81) ; U7.3 23.11,59.88 v3(23.11,59.19)
  Bottom Layer w0.25: v3(23.11,59.19) 23.11,65.03 v3(21.34,66.81)
TODEMO_SWDIO: length 27.6
  Top Layer w0.25: v3(30.61,50.17) 30.62,50.15 R18.1 ; v3(25.4,55.88) 26.98,54.3 ; 26.98,54.3 26.98,51.38 v3(27.56,50.8) ; 26.98,54.3 U6.3 ; U3.27 21.31,67.72 23.37,65.66 25.02,65.66 25.39,65.29 R12.2 25.39,63 v3(25.4,63)
  Bottom Layer w0.25: v3(25.4,55.88) v3(25.4,63) ; v3(27.56,50.8) 29.97,50.8 v3(30.61,50.17)
TODEMO_UART_RX: length 11.7
  Top Layer w0.25: R14.1 v3(11.56,57.79) ; U3.13 13,64.05 13.46,63.58 13.46,60.33 13.02,59.89 10.73,59.89 v3(10.67,59.82)
  Bottom Layer w0.25: v3(10.67,59.82) 10.67,58.68 v3(11.56,57.79)
TODEMO_UART_TX: length 16.9
  Top Layer w0.25: U4.3 6.28,54.43 5.84,54.87 5.84,60.33 8.89,63.38 8.89,65.66 9.95,66.72 U3.12
USB_ENUM: length 9.5
  Top Layer w0.25: R1.2 28.92,69.47 v3(27.94,69.47) ; v3(21.59,68.2) 21.57,68.22 U3.28
  Bottom Layer w0.25: v3(27.94,69.47) 26.67,68.2 v3(21.59,68.2)
$1N19114: length 5
  Top Layer w0.25: R1.1 32.02,67.96 Q1.1
$1N21265: length 6.3
  Top Layer w0.25: R2.2 33.51,72.27 Q1.3
$1N43105: length 5.4
  Top Layer w0.25: USB1.B5 21.62,75.79 23.88,73.53 R4.1
$1N43548: length 14
  Top Layer w0.25: v3(26.67,71.12) 26.16,70.62 R6.2 ; USB1.A5 24.62,75.46 25.02,75.06 28.07,75.06 v3(29.08,76.08)
  Bottom Layer w0.25: v3(26.67,71.12) 29.08,73.54 v3(29.08,76.08)
$2N1934: length 4.7
  Top Layer w0.25: R12.1 22.73,64.65 20.66,66.72 U3.25
$2N4921: length 2.3
  Top Layer w0.25: U4.4 10.29,53.36 R13.1
$2N12506: length 3.5
  Top Layer w0.25: U6.4 30.04,54.3 28.71,52.97 R20.1
$2N12712: length 2.3
  Top Layer w0.25: U8.4 20.7,53.23 R22.1
$2N15422: length 2.9
  Top Layer w0.25: R8.1 15.49,76.2 15.49,76.2 15.49,75.7 15,75.2 U3.44
$2N18611: length 2.1
  Top Layer w0.25: R7.1 4.98,75.58 LED1.2
$2N18724: length 2
  Top Layer w0.25: LED2.2 5.21,74.12 R9.1
$2N18837: length 2.1
  Top Layer w0.25: R10.1 4.96,72.65 LED3.2
$2N21012: length 3.6
  Top Layer w0.25: U7.4 24.96,59.89 23.62,58.55 R21.1
$2N29349: length 19.6
  Top Layer w0.25: R16.1 v3(15.49,56.01) 15.49,58.68 15.11,59.06 15.11,59.88 U5.4 ; R15.2 v3(25.53,48.9)
  Bottom Layer w0.25: v3(15.49,56.01) 18.41,56.01 v3(25.53,48.9)
$3N25357: length 4.2
  Top Layer w0.25: 9.99,26.97 9.99,27.52 10.29,27.82 13.4,27.82 R26.2
$3N25358: length 4.9
  Top Layer w0.25: 9.99,28.67 9.99,29.49 10.73,30.23 12.83,30.23 R25.2
$3N25359: length 3
  Top Layer w0.25: R23.2 11.3,26.17 11.09,26.38 LED4.4

## Copper pours and planes (outline as drawn; the poured copper is in the pictures)
GND on Top Layer: 0,84.33 0,0.26 43.56,0.26 43.56,84.33
GND on Bottom Layer: 0.25,84.33 0.25,0.26 43.81,0.26 43.81,84.33

## Text on the board
Top Silkscreen Layer: vdd swclk swdio gnd | PA3 | PD4 | PD5 | PD6 | PB0 | PA1 | PA2 | GND | PB1 | VDD | POWER | NRST | TX | RX | SWDIO | SWCLK | PD3 | PD2 | PD1 | PC7 | PC6 | PC5 | PC4 | PC3 | PB4 | PB5 | PT32Y003x Development Kit / 澎湃微电子 / 20221228 | 外设供电 | MCU供电 | PB1/SWDIO/PC7 | 3.3V / 5V
